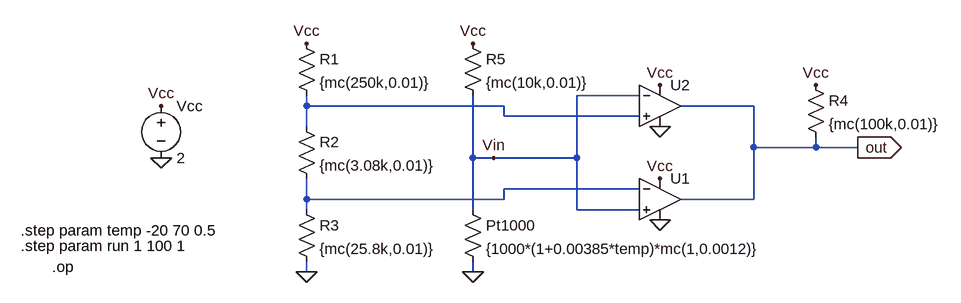
[diagram p0: schematic Draft1.asc]
Draft1.asc, the LTspice schematic file:
Version 4.1
SHEET 1 1248 680
WIRE 752 128 656 128
WIRE 240 144 240 128
WIRE 544 144 240 144
WIRE 928 144 816 144
WIRE 544 160 544 144
WIRE 752 160 544 160
WIRE 240 176 240 144
WIRE 928 208 928 144
WIRE 1024 208 1024 192
WIRE 1024 208 928 208
WIRE 1088 208 1024 208
WIRE 496 224 496 128
WIRE 528 224 496 224
WIRE 656 224 656 128
WIRE 656 224 528 224
WIRE 752 272 544 272
WIRE 240 288 240 256
WIRE 544 288 544 272
WIRE 544 288 240 288
WIRE 928 288 928 208
WIRE 928 288 816 288
WIRE 240 304 240 288
WIRE 496 304 496 224
WIRE 656 304 656 224
WIRE 752 304 656 304
WIRE 240 400 240 384
WIRE 496 400 496 384
FLAG 240 400 0
FLAG 240 48 Vcc
FLAG 1024 112 Vcc
FLAG 16 144 Vcc
FLAG 16 224 0
FLAG 784 176 0
FLAG 784 112 Vcc
FLAG 784 320 0
FLAG 784 256 Vcc
FLAG 1088 208 out
IOPIN 1088 208 Out
FLAG 496 48 Vcc
FLAG 528 224 Vin
FLAG 496 400 0
SYMBOL res 224 32 R0
SYMATTR InstName R1
SYMATTR Value {mc(250k,0.01)}
SYMBOL res 224 160 R0
SYMATTR InstName R2
SYMATTR Value {mc(3.08k,0.01)}
SYMBOL res 224 288 R0
SYMATTR InstName R3
SYMATTR Value {mc(25.8k,0.01)}
SYMBOL res 1008 96 R0
SYMATTR InstName R4
SYMATTR Value {mc(100k,0.01)}
SYMBOL voltage 16 128 R0
SYMATTR InstName Vcc
SYMATTR Value 2
SYMBOL OpAmps\\UniversalOpAmp2 784 144 R0
SYMATTR InstName U2
SYMBOL OpAmps\\UniversalOpAmp2 784 288 R0
SYMATTR InstName U1
SYMBOL res 480 288 R0
SYMATTR InstName Pt1000
SYMATTR Value {1000*(1+0.00385*temp)*mc(1,0.0012)}
SYMBOL res 480 32 R0
SYMATTR InstName R5
SYMATTR Value {mc(10k,0.01)}
TEXT -200 336 Left 2 !.step param temp -20 70 0.5
TEXT -152 392 Left 2 !.op
TEXT -200 360 Left 2 !.step param run 1 100 1

The netlist it stands for:
* Draft1.asc
R1 Vcc N001 {mc(250k,0.01)}
R2 N001 N002 {mc(3.08k,0.01)}
R3 N002 0 {mc(25.8k,0.01)}
R4 Vcc out {mc(100k,0.01)}
Vcc Vcc 0 2
X§U2 N001 Vin Vcc 0 out level2 Avol=1Meg GBW=10Meg Slew=10Meg Ilimit=25m Rail=0 Vos=0 En=0 Enk=0 In=0 Ink=0 Rin=500Meg  ; pins In+ In- V+ V- OUT
X§U1 Vin N002 Vcc 0 out level2 Avol=1Meg GBW=10Meg Slew=10Meg Ilimit=25m Rail=0 Vos=0 En=0 Enk=0 In=0 Ink=0 Rin=500Meg  ; pins In+ In- V+ V- OUT
R§Pt1000 Vin 0 {1000*(1+0.00385*temp)*mc(1,0.0012)}
R5 Vcc Vin {mc(10k,0.01)}
.step param temp -20 70 0.5
.op
.step param run 1 100 1
.lib UniversalOpAmp2.lib
.backanno
.end